# EAGLE design Dumptruck2017 (EAGLE 7.6.0)
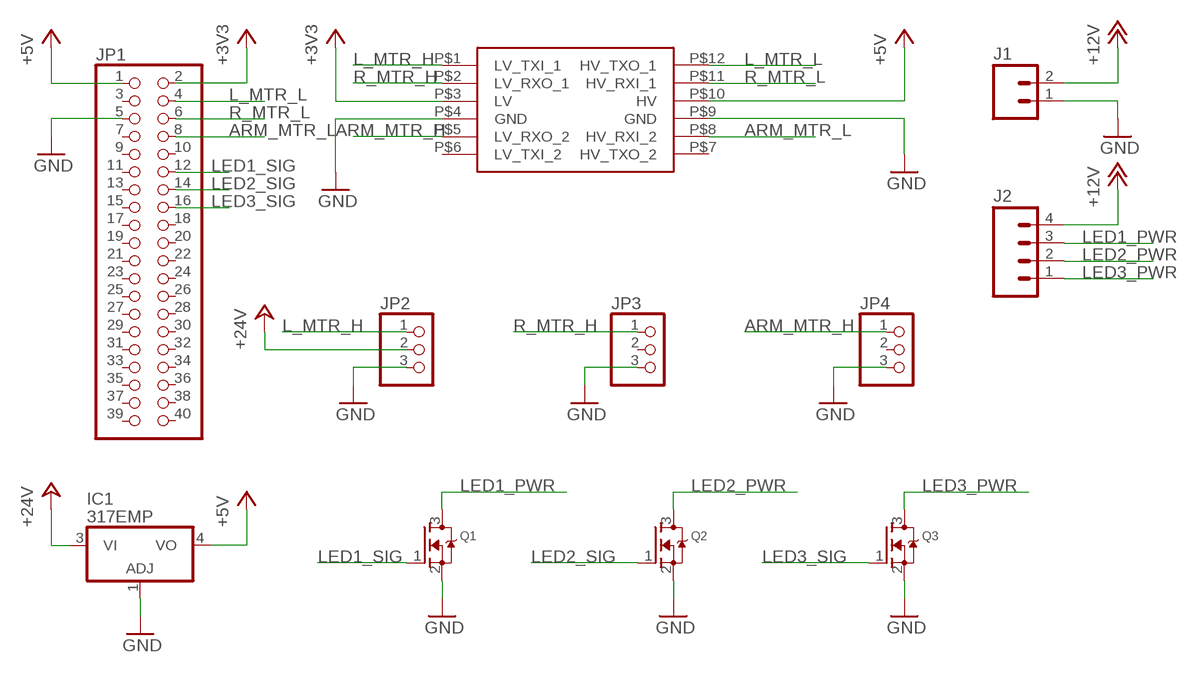
[diagram p0: schematic, sheet 1]

## Parts
IC1  317EMP  [SOT223]
J1  M02LOCK  [1X02_LOCK]
J2  M04LOCK  [1X04_LOCK]
JP1  PINHD-2X20  [2X20]
JP2  PINHD-1X3  [1X03]
JP3  PINHD-1X3  [1X03]
JP4  PINHD-1X3  [1X03]
Q1  MOSFET-NREFLOW  [SOT23]
Q2  MOSFET-NREFLOW  [SOT23]
Q3  MOSFET-NREFLOW  [SOT23]
U$1  LOGIC_LEVEL_CONVERTER  [LOGIC_LEVEL_CONVERTER]

## Nets
+3V3: JP1.2 U$1.P$3(LV)
+5V: IC1.4(VO) JP1.1 U$1.P$10(HV)
+12V: J1.2 J2.4
+24V: IC1.3(VI) JP2.2
ARM_MTR_H: JP4.1 U$1.P$5(LV_RXO_2)
ARM_MTR_L: JP1.8 U$1.P$8(HV_RXI_2)
GND: IC1.1(ADJ) J1.1 JP1.5 JP2.3 JP3.3 JP4.3 Q1.2(S) Q2.2(S) Q3.2(S) U$1.P$4(GND) U$1.P$9(GND)
L_MTR_H: JP2.1 U$1.P$1(LV_TXI_1)
L_MTR_L: JP1.4 U$1.P$12(HV_TXO_1)
LED1_PWR: J2.3 Q1.3(D)
LED1_SIG: JP1.12 Q1.1(G)
LED2_PWR: J2.2 Q2.3(D)
LED2_SIG: JP1.14 Q2.1(G)
LED3_PWR: J2.1 Q3.3(D)
LED3_SIG: JP1.16 Q3.1(G)
R_MTR_H: JP3.1 U$1.P$2(LV_RXO_1)
R_MTR_L: JP1.6 U$1.P$11(HV_RXI_1)
Unconnected: JP1.3 JP1.7 JP1.9 JP1.10 JP1.11 JP1.13 JP1.15 JP1.17 JP1.18 JP1.19 JP1.20 JP1.21 JP1.22 JP1.23 JP1.24 JP1.25 JP1.26 JP1.27 JP1.28 JP1.29 JP1.30 JP1.31 JP1.32 JP1.33 JP1.34 JP1.35 JP1.36 JP1.37 JP1.38 JP1.39 JP1.40 JP3.2 JP4.2 U$1.P$6(LV_TXI_2) U$1.P$7(HV_TXO_2)

## Library data of the parts
IC1 = linear:*317: Positive VOLTAGE REGULATOR
J1 = SparkFun-Connectors:M02: Standard 2-pin 0.1" header. Use with - straight break away headers ( PRT-00116) - right angle break away headers (PRT-00553) - swiss pins (PRT-00743) - machine pins (PRT-00117) - female headers (PRT-00115) Molex polarized connector foot print use with: PRT-08233 with associated crimp pins and housings. 2.54_SCREWTERM for use with PRT-10571. 3.5mm Screw Terminal footprints for PRT-08084 5mm Screw Terminal footprints for use with PRT-08432
J2 = SparkFun-Connectors:M04: Header 4 Standard 4-pin 0.1" header. Use with straight break away headers (SKU : PRT-00116), right angle break away headers (PRT-00553), swiss pins (PRT-00743), machine pins (PRT-00117), and female headers (PRT-00115). Molex polarized connector foot print use with SKU : PRT-08231 with associated crimp pins and housings. 1MM SMD Version SKU: PRT-10208; PROD_ID: CONN-09696
JP1 = adafruit:PINHD-2X20: PIN HEADER
JP2-JP4 = adafruit:PINHD-1X3: PIN HEADER
Q1-Q3 = adafruit:MOSFET-N: N-Channel Mosfet 2N7002E - 60V 260mA SOT23 [Digikey: 2N7002ET1GOSTR-ND] - REEL BSH103 - 30V 850mA SOT23 [Digikey: 568-5013-1-ND]
U$1 = SparkFun-Boards:LOGIC_LEVEL_CONVERTER: Logic Level Converter (3.3v - 5v) https://www.sparkfun.com/products/8745

## Board
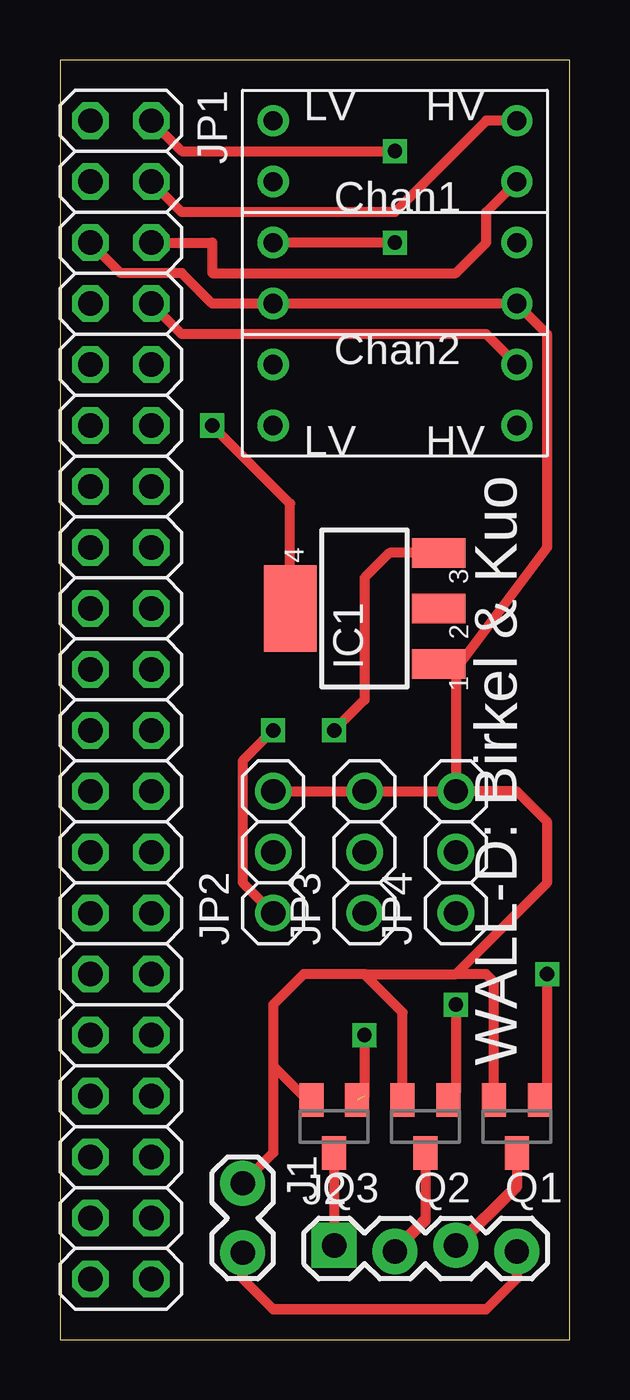
[diagram p1: board, top side]
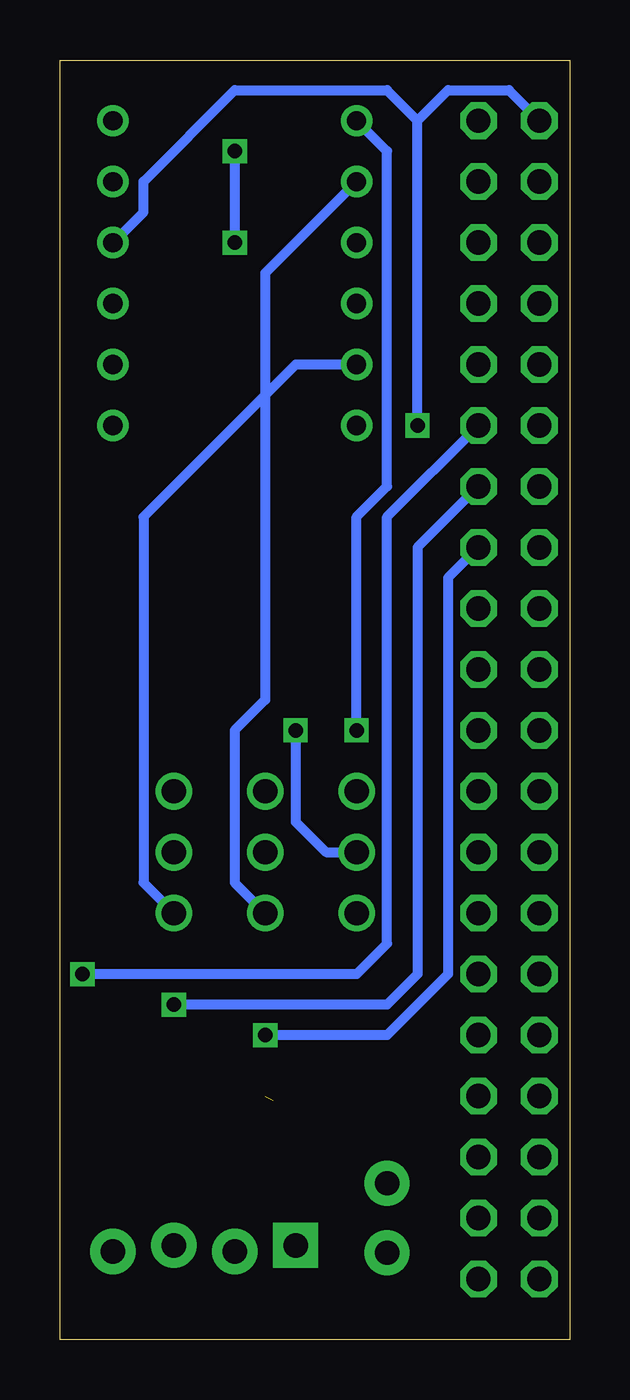
[diagram p2: board, bottom side, seen from below]

Size 21.26 x 53.33 mm. Coordinates in mm from the lower left corner, seen from the top.
Outline: 0,0 21.26,0 21.26,53.33 0,53.33 0,0
Copper layers (1*16): Top 0.035mm / dielectric 1.5mm / Bottom 0.035mm
Design rules "default": minimum track width 10mil, minimum drill 24mil, track to track 8mil, track to pad 8mil, pad to pad 8mil, via to via 8mil, smd to smd 8mil, copper to edge 40mil, drill to drill 8mil, minimum pad ring 10mil, minimum via ring 8mil, stop-mask expansion 4mil, vias tented up to drill 0mil, thermal gap 10mil

### Footprints (pad centres in the part's own frame; a part is rotated, then mirrored left to right if it is on the bottom)
SOT223 = smd 1.219 x 2.235: 1 -2.311,-3.099; 2 0,-3.099; 3 2.311,-3.099 | smd 3.6 x 2.2: 4 0,3.099
1X02_LOCK = drill 1.016 pad 1.88: 1 -0.178,0; 2 2.718,0
1X04_LOCK = drill 1.016 pad 1.88 square: 1 0,0.127 | drill 1.016 pad 1.88: 2 2.54,-0.127; 3 5.08,0.127; 4 7.62,-0.127
2X20 = drill 1.016 octagon: 1 -24.13,-1.27; 2 -24.13,1.27; 3 -21.59,-1.27; 4 -21.59,1.27; 5 -19.05,-1.27; 6 -19.05,1.27; 7 -16.51,-1.27; 8 -16.51,1.27; 9 -13.97,-1.27; 10 -13.97,1.27; 11 -11.43,-1.27; 12 -11.43,1.27; 13 -8.89,-1.27; 14 -8.89,1.27; 15 -6.35,-1.27; 16 -6.35,1.27; 17 -3.81,-1.27; 18 -3.81,1.27; 19 -1.27,-1.27; 20 -1.27,1.27; 21 1.27,-1.27; 22 1.27,1.27; 23 3.81,-1.27; 24 3.81,1.27; 25 6.35,-1.27; 26 6.35,1.27; 27 8.89,-1.27; 28 8.89,1.27; 29 11.43,-1.27; 30 11.43,1.27; 31 13.97,-1.27; 32 13.97,1.27; 33 16.51,-1.27; 34 16.51,1.27; 35 19.05,-1.27; 36 19.05,1.27; 37 21.59,-1.27; 38 21.59,1.27; 39 24.13,-1.27; 40 24.13,1.27
1X03 = drill 1.016: 1 -2.54,0; 2 0,0; 3 2.54,0
SOT23 = smd 1 x 1.4: 1 -0.95,-1.1; 2 0.95,-1.1; 3 0,1.1
LOGIC_LEVEL_CONVERTER = drill 0.8: P$1 1.27,13.97; P$2 1.27,11.43; P$3 1.27,8.89; P$4 1.27,6.35; P$5 1.27,3.81; P$6 1.27,1.27; P$7 11.43,1.27; P$8 11.43,3.81; P$9 11.43,6.35; P$10 11.43,8.89; P$11 11.43,11.43; P$12 11.43,13.97

### Placement (x,y rotation side)
IC1  12.7,30.48 90 top
J1  7.62,6.35 270 top
J2  11.43,3.81 0 top
JP1  2.54,26.67 270 top
JP2  8.89,20.32 90 top
JP3  12.7,20.32 90 top
JP4  16.51,20.32 90 top
Q1  19.05,8.89 180 top
Q2  15.24,8.89 180 top
Q3  11.43,8.89 180 top
U$1  7.62,36.83 0 top

### Tracks (layer width: path | path; a pad name or v marks a point on that pad's centre or on a via)
+3V3  (via drill 0.6)
  Top 0.406: JP1.2 5.08,49.53 v13.97,49.53 | v13.97,45.72 U$1.P$3
  Bottom 0.406: v13.97,49.53 v13.97,45.72
+5V  (via drill 0.6)
  Top 0.406: IC1.4 9.6,34.85 v6.35,38.1
  Bottom 0.406: v6.35,38.1 6.35,50.8 | 6.35,50.8 5.08,52.07 2.54,52.07 JP1.1 | U$1.P$10 17.78,46.99 17.78,48.26 13.97,52.07 7.62,52.07 6.35,50.8
+12V
  Top 0.406: J1.2 7.62,2.54 8.89,1.27 17.78,1.27 19.05,2.54 J2.4
+24V  (via drill 0.6)
  Top 0.406: IC1.3 13.74,32.79 12.7,31.75 12.7,26.67 v11.43,25.4
  Bottom 0.406: v11.43,25.4 11.43,21.59 10.16,20.32 JP2.2
ARM_MTR_H
  Bottom 0.406: U$1.P$5 11.43,40.64 17.78,34.29 17.78,19.05 JP4.1
ARM_MTR_L
  Top 0.406: U$1.P$8 17.78,41.91 5.08,41.91 JP1.8
GND
  Top 0.406: JP4.3 JP3.3 JP2.3 | IC1.1 16.51,28.17 16.51,27.94 | 16.51,27.94 JP4.3 | JP1.5 2.54,44.45 5.08,44.45 6.35,43.18 U$1.P$4 U$1.P$9 20.32,41.91 20.32,33.02 16.51,27.94 | Q1.2 18.1,14.92 17.78,15.24 16.51,15.24 | 12.7,15.24 10.16,15.24 8.89,13.97 8.89,11.43 | 8.89,11.43 8.89,7.8 J1.1 | Q2.2 14.29,13.65 12.7,15.24 | Q3.2 10.33,9.99 8.89,11.43 | 12.7,15.24 16.51,15.24 | 16.51,15.24 20.32,19.05 20.32,21.59 19.05,22.86 JP4.3
L_MTR_H  (via drill 0.6)
  Top 0.406: v8.89,25.4 7.62,24.13 7.62,19.05 JP2.1
  Bottom 0.406: U$1.P$1 7.62,49.53 7.62,35.56 8.89,34.29 v8.89,25.4
L_MTR_L
  Top 0.406: U$1.P$12 17.78,50.8 13.97,46.99 5.08,46.99 JP1.4
LED1_PWR
  Top 0.406: Q1.3 19.05,6.35 18.92,6.35 J2.3
LED1_SIG  (via drill 0.6)
  Top 0.406: Q1.1 20.32,9.99 v20.32,15.24
  Bottom 0.406: JP1.12 7.62,34.29 7.62,16.51 8.89,15.24 v20.32,15.24
LED2_PWR
  Top 0.406: Q2.3 15.24,4.95 J2.2
LED2_SIG  (via drill 0.6)
  Top 0.406: v16.51,13.97 16.51,10.31 Q2.1
  Bottom 0.406: JP1.14 6.35,33.02 6.35,15.24 7.62,13.97 v16.51,13.97
LED3_PWR
  Top 0.406: Q3.3 J2.1
LED3_SIG  (via drill 0.6)  (1 unrouted)
  Top 0.406: v12.7,12.7 12.7,10.16
  Bottom 0.406: JP1.16 5.08,31.75 5.08,15.24 7.62,12.7 v12.7,12.7
N$1
  Top 0.406: 19.05,7.62 19.05,6.35 16.51,3.81
N$2
  Top 0.406: 15.24,7.62 15.24,5.08 13.97,3.81
N$3
  Top 0.406: 11.43,7.62 11.43,3.81
N$4
  Top 0.406: 19.05,3.81 19.05,2.54 17.78,1.27 8.89,1.27 7.62,2.54 7.62,3.81
R_MTR_H
  Bottom 0.406: U$1.P$2 12.7,44.45 12.7,26.67 13.97,25.4 13.97,19.05 JP3.1
R_MTR_L
  Top 0.406: JP1.6 6.35,45.72 6.35,44.45 16.51,44.45 17.78,45.72 17.78,46.99 U$1.P$11

### Text on the board
tPlace: WALL-D: Birkel & Kuo